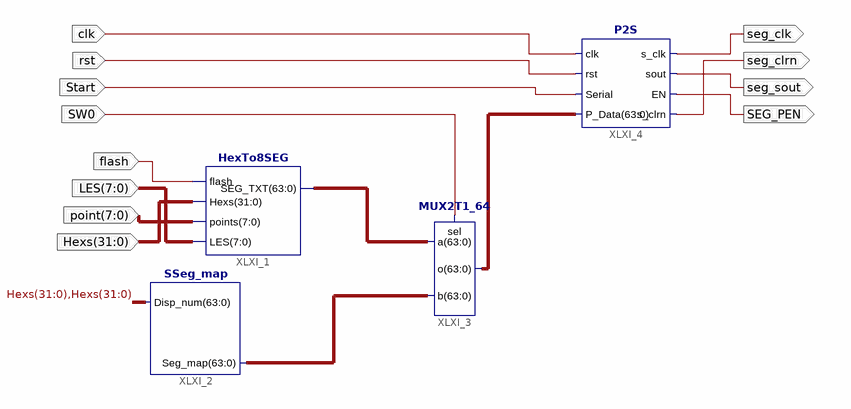
[diagram p0: schematic sheet 1]
// Xilinx ISE schematic SSeg7_Dev.sch (kintex7) as structural Verilog: 4 symbols, 12 ports
module SSeg7_Dev (
  input  clk,
  input  rst,
  input  Start,
  input  SW0,
  input  flash,
  input  [7:0] point,
  input  [7:0] LES,
  input  [31:0] Hexs,
  output seg_clk,
  output seg_clrn,
  output seg_sout,
  output SEG_PEN
);

  wire [63:0] XLXN_16, XLXN_26, XLXN_27;

  HexTo8SEG XLXI_1 (.LES(LES), .points(point), .Hexs(Hexs), .SEG_TXT(XLXN_26), .flash(flash));
  SSeg_map XLXI_2 (.Disp_num({Hexs, Hexs}), .Seg_map(XLXN_27));
  MUX2T1_64 XLXI_3 (.b(XLXN_27), .sel(SW0), .a(XLXN_26), .o(XLXN_16));
  P2S XLXI_4 (
    .s_clrn(seg_clrn), .sout(seg_sout), .rst(rst), .EN(SEG_PEN), .Serial(Start), .clk(clk), .s_clk(seg_clk),
    .P_Data(XLXN_16));
endmodule
